# Altium schematic sheet FC.SchDoc
size A4
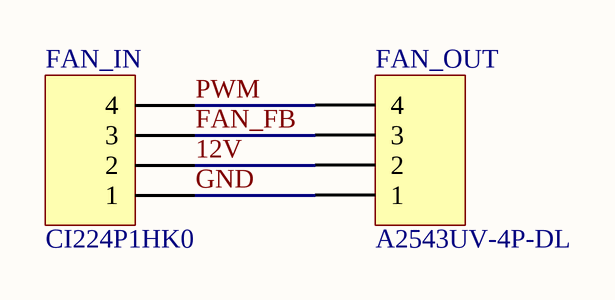
[diagram p0: FC.SchDoc]

## Parts
FAN_IN  CI224P1HK0  [XH-4AW]
FAN_OUT  A2543UV-4P-DL  [FAN]

## Nets
12V: FAN_IN.2 FAN_OUT.2
FAN_FB: FAN_IN.3 FAN_OUT.3
GND: FAN_IN.1 FAN_OUT.1
PWM: FAN_IN.4 FAN_OUT.4

## Library data of the parts
FAN_IN FAN_OUT = Header 4H: Header, 4-Pin, Right Angle; LatestRevisionDate: 17-Jul-2002; LatestRevisionNote: Re-released for DXP Platform.; Publisher: Altium Limited